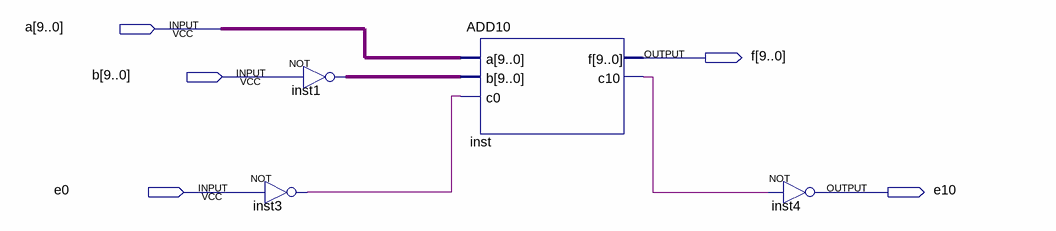
[diagram p0: schematic sheet]
// Quartus schematic SUB10.bdf as structural Verilog: 4 symbols, 5 pins
module SUB10 (
  input  [9:0] a,
  input  [9:0] b,
  input  e0,
  output [9:0] f,
  output e10
);

  wire inst3_out, inst_c10;
  wire [9:0] inst1_out;

  not inst3 (inst3_out, e0);
  assign inst1_out = ~b;  // NOT inst1, 10 bits wide
  ADD10 inst (.a(a), .b(inst1_out), .c0(inst3_out), .f(f), .c10(inst_c10));
  not inst4 (e10, inst_c10);
endmodule
